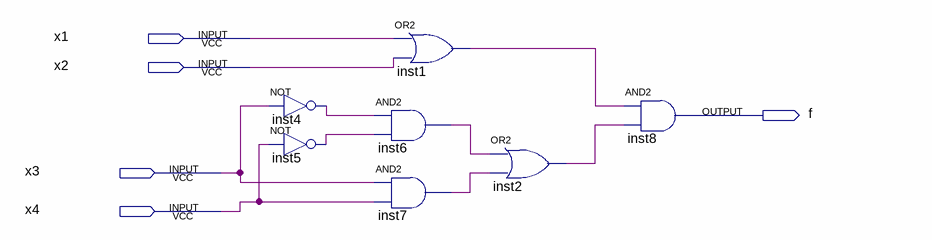
[diagram p0: schematic sheet]
// Quartus schematic erg2.bdf as structural Verilog: 7 symbols, 5 pins
module erg2 (
  input  x1,
  input  x2,
  input  x3,
  input  x4,
  output f
);

  wire inst1_out, inst2_out, inst4_out, inst5_out, inst6_out, inst7_out;

  not inst4 (inst4_out, x3);
  not inst5 (inst5_out, x4);
  or inst1 (inst1_out, x1, x2);
  and inst6 (inst6_out, inst4_out, inst5_out);
  and inst7 (inst7_out, x3, x4);
  or inst2 (inst2_out, inst6_out, inst7_out);
  and inst8 (f, inst1_out, inst2_out);
endmodule
